# EAGLE design working (EAGLE 5.11)
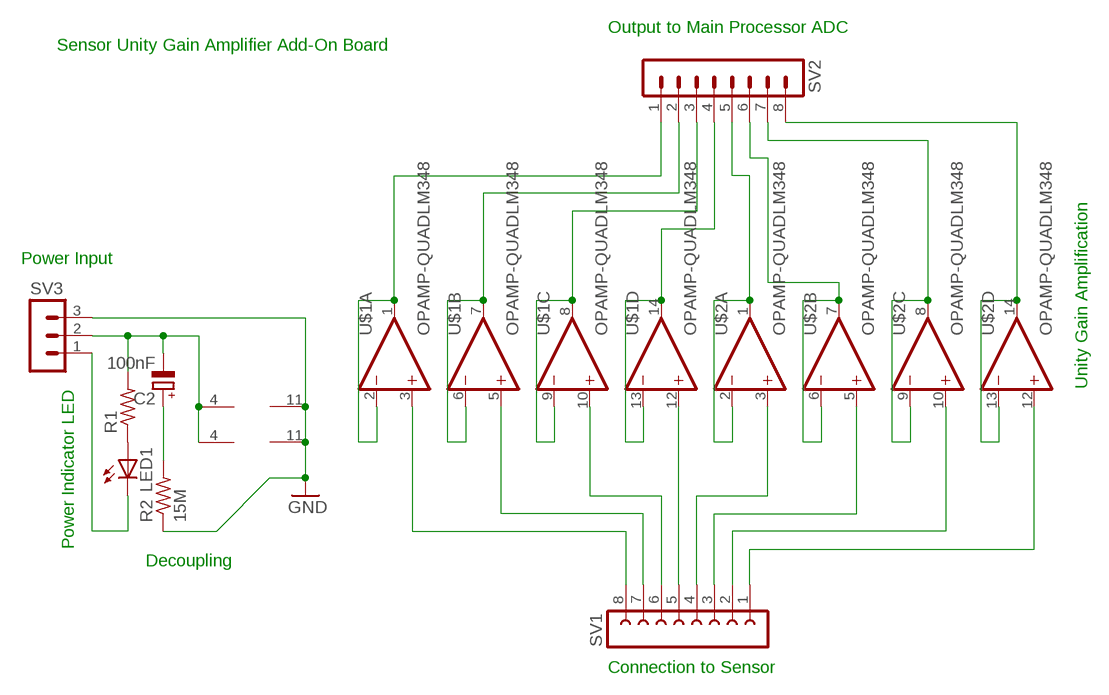
[diagram p0: schematic, sheet 1]

## Parts
C2  100nF  CPOL-EUE1.8-4  [E1,8-4]
LED1  LED5MM  [LED5MM]
R1  R-US_0204/5  [0204/5]
R2  15M  R-US_0204/5  [0204/5]
SV1  FE08-1  [FE08]
SV2  MA08-1  [MA08-1]
SV3  MA03-1  [MA03-1]
U$1  OPAMP-QUADLM348  [DIP14]
U$2  OPAMP-QUADLM348  [DIP14]

## Nets
GND: R2.1 SV3.3 U$1.11(SUP:VEE) U$2.11(SUP:VEE)
N$1: SV2.1 U$1.1(A:OUT) U$1.2(A:IN-)
N$2: SV2.2 U$1.6(B:IN-) U$1.7(B:OUT)
N$3: SV2.3 U$1.8(C:OUT) U$1.9(C:IN-)
N$4: SV2.4 U$1.13(D:IN-) U$1.14(D:OUT)
N$5: SV2.5 U$2.1(A:OUT) U$2.2(A:IN-)
N$6: SV2.6 U$2.6(B:IN-) U$2.7(B:OUT)
N$7: SV2.7 U$2.8(C:OUT) U$2.9(C:IN-)
N$8: SV2.8 U$2.13(D:IN-) U$2.14(D:OUT)
N$9: SV1.8 U$1.3(A:IN+)
N$10: SV1.7 U$1.5(B:IN+)
N$11: SV1.6 U$1.10(C:IN+)
N$12: SV1.5 U$1.12(D:IN+)
N$13: SV1.4 U$2.3(A:IN+)
N$14: SV1.3 U$2.5(B:IN+)
N$15: SV1.2 U$2.10(C:IN+)
N$16: SV1.1 U$2.12(D:IN+)
N$18: C2.+ R2.2
N$19: LED1.A R1.1
N$20: LED1.K(C) SV3.1
N$21: C2.- R1.2 SV3.2 U$1.4(SUP:VCC) U$2.4(SUP:VCC)

## Notes on the sheet
- Output to Main Processor ADC
- Sensor Unity Gain Amplifier Add-On Board
- Power Input
- Unity Gain Amplification
- Power Indicator LED
- Decoupling
- Connection to Sensor

## Library data of the parts
C2 = rcl:CPOL-EU: POLARIZED CAPACITOR, European symbol
LED1 = led:LED: LED OSRAM: - CHIPLED LG R971, LG N971, LY N971, LG Q971, LY Q971, LO R971, LY R971 LH N974, LH R974 LS Q976, LO Q976, LY Q976 LO Q996 - Hyper CHIPLED LW Q18S LB Q993, LB Q99A, LB R99A - SideLED LS A670, LO A670, LY A670, LG A670, LP A670 LB A673, LV A673, LT A673, LW A673 LH A674 LY A675 LS A676, LA A676, LO A676, LY A676, LW A676 LS A679, LY A679, LG A679 - Hyper Micro SIDELED® LS Y876, LA Y876, LO Y876, LY Y876 LT Y87S - SmartLED LW L88C, LW L88S LB L89C, LB L89S, LG L890 LS L89K, LO L89K, LY L89K LS L896, LA L896, LO L896, LY L896 - TOPLED LS T670, LO T670, LY T670, LG T670, LP T670 LSG T670, LSP T670, LSY T670, LOP T670, LYG T670 LG T671, LOG T671, LSG T671 LB T673, LV T673, LT T673, LW T673 LH T674 LS T676, LA T676, LO T676, LY T676, LB T676, LH T676, LSB T676, LW T676 LB T67C, LV T67C, LT T67C, LS T67K, LO T67K, LY T67K, LW E67C LS E67B, LA E67B, LO E67B, LY E67B, LB E67C, LV E67C, LT E67C LW T67C LS T679, LY T679, LG T679 LS T770, LO T770, LY T770, LG T770, LP T770 LB T773, LV T773, LT T773, LW T773 LH T774 LS E675, LA E675, LY E675, LS T675 LS T776, LA T776, LO T776, LY T776, LB T776 LHGB T686 LT T68C, LB T68C - Hyper Mini TOPLED® LB M676 - Mini TOPLED Santana® LG M470 LS M47K, LO M47K, LY M47K Source: http://www.osram.convergy.de LUXEON: - LUMILED® LXK2-PW12-R00, LXK2-PW12-S00, LXK2-PW14-U00, LXK2-PW14-V00 LXK2-PM12-R00, LXK2-PM12-S00, LXK2-PM14-U00 LXK2-PE12-Q00, LXK2-PE12-R00, LXK2-PE12-S00, LXK2-PE14-T00, LXK2-PE14-U00 LXK2-PB12-K00, LXK2-PB12-L00, LXK2-PB12-M00, LXK2-PB14-N00, LXK2-PB14-P00, LXK2-PB14-Q00 LXK2-PR12-L00, LXK2-PR12-M00, LXK2-PR14-Q00, LXK2-PR14-R00 LXK2-PD12-Q00, LXK2-PD12-R00, LXK2-PD12-S00 LXK2-PH12-R00, LXK2-PH12-S00 LXK2-PL12-P00, LXK2-PL12-Q00, LXK2-PL12-R00 Source: www.luxeon.com KINGBRIGHT: KA-3528ASYC Source: www.kingbright.com
R1 R2 = resistor:R-US_: RESISTOR, American symbol
SV1 = con-lsta:FE08-1: FEMALE HEADER; OC_FARNELL: unknown; OC_NEWARK: unknown
SV2 = con-lstb:MA08-1: PIN HEADER; OC_FARNELL: unknown; OC_NEWARK: unknown
SV3 = con-lstb:MA03-1: PIN HEADER; OC_FARNELL: unknown; OC_NEWARK: unknown
U$1 U$2 = Op Amps:OPAMP-QUAD: Operational amplifier, quad; SPICE: X{NAME}A {A.IN+.NET} {A.IN-.NET} {VCC.NET} {VEE.NET} {A.OUT.NET} LM348\nX{NAME}B {B.IN+.NET} {B.IN-.NET} {VCC.NET} {VEE.NET} {B.OUT.NET} LM348\nX{NAME}C {C.IN+.NET} {C.IN-.NET} {VCC.NET} {VEE.NET} {C.OUT.NET} LM348\nX{NAME}D {D.IN+.NET} {D.IN-.NET} {VCC.NET} {VEE.NET} {D.OUT.NET} LM348; SPICEMOD: .SUBCKT LM358 1 2 99 50 28\nIOS 2 1 5N\nR1 1 3 500K\nR2 3 2 500K\nI1 99 4 100U\nR3 5 50 517\nR4 6 50 517\nQ1 5 2 4 QX\nQ2 6 7 4 QX\nC4 5 6 128.27P\nI2 99 50 75U\nEOS 7 1 POLY(1) 16 49 2E-3 1\nR8 99 49 60K\nR9 49 50 60K\nV2 99 8 1.63\nD1 9 8 DX\nD2 10 9 DX\nV3 10 50 .635\nEH 99 98 99 49 1\nG1 98 9 POLY(1) 5 6 0 9.8772E-4 0 .3459\nR5 98 9 101.2433MEG\nC3 98 9 200P\nG3 98 15 9 49 1E-6\nR12 98 15 1MEG\nC5 98 15 7.9577E-14\nG4 98 16 3 49 5.6234E-8 \nL2 98 17 15.9M\nR13 17 16 1K\nF6 50 99 POLY(1) V6 300U 1\nE1 99 23 99 15 1\nR16 24 23 17.5\nD5 26 24 DX\nV6 26 22 .63V\nR17 23 25 17.5\nD6 25 27 DX\nV7 22 27 .63V\nV5 22 21 0.27V\nD4 21 15 DX\nV4 20 22 0.27V\nD3 15 20 DX\nL3 22 28 500P\nRL3 22 28 100K\n.MODEL DX D(IS=1E-15)\n.MODEL QX PNP(BF=1.111E3)\n.ENDS

## Board
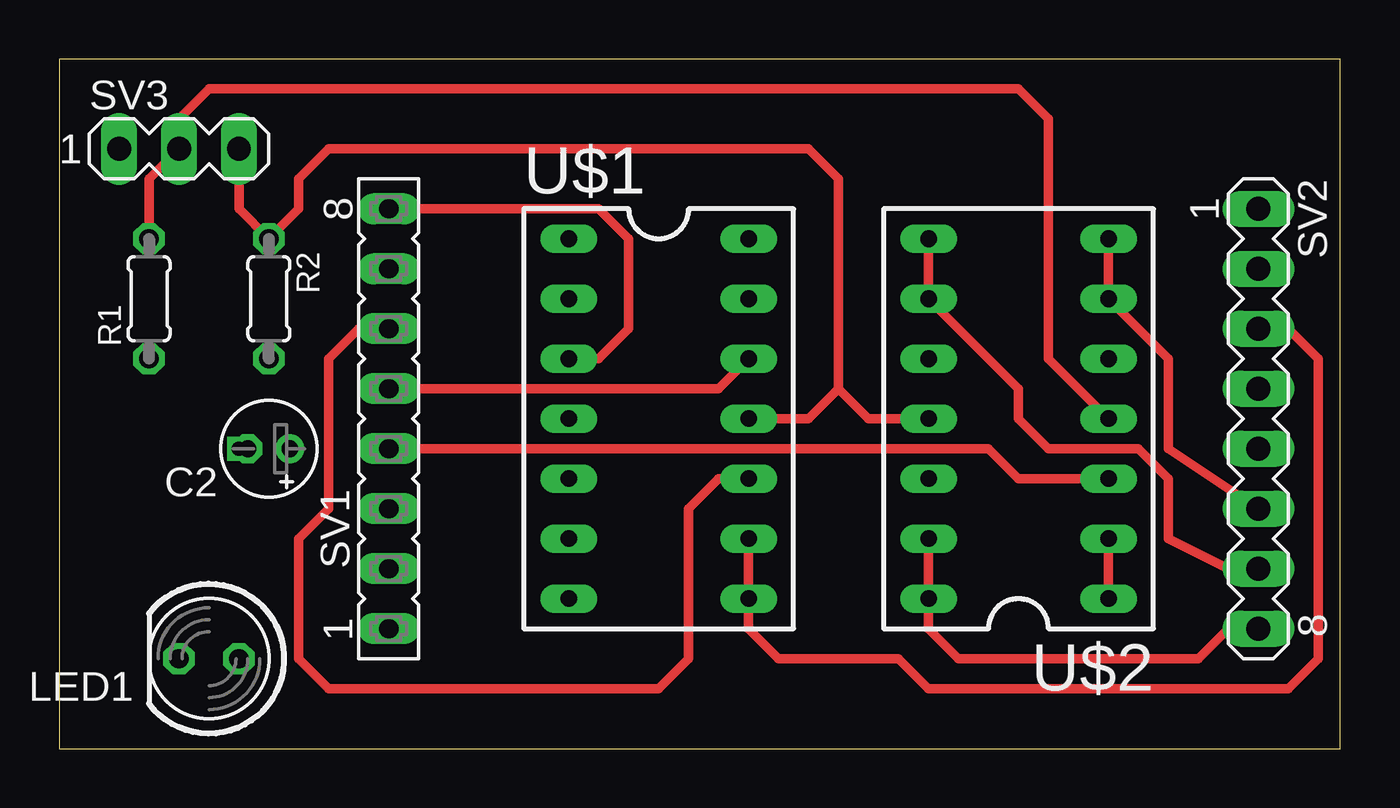
[diagram p1: board, top side]
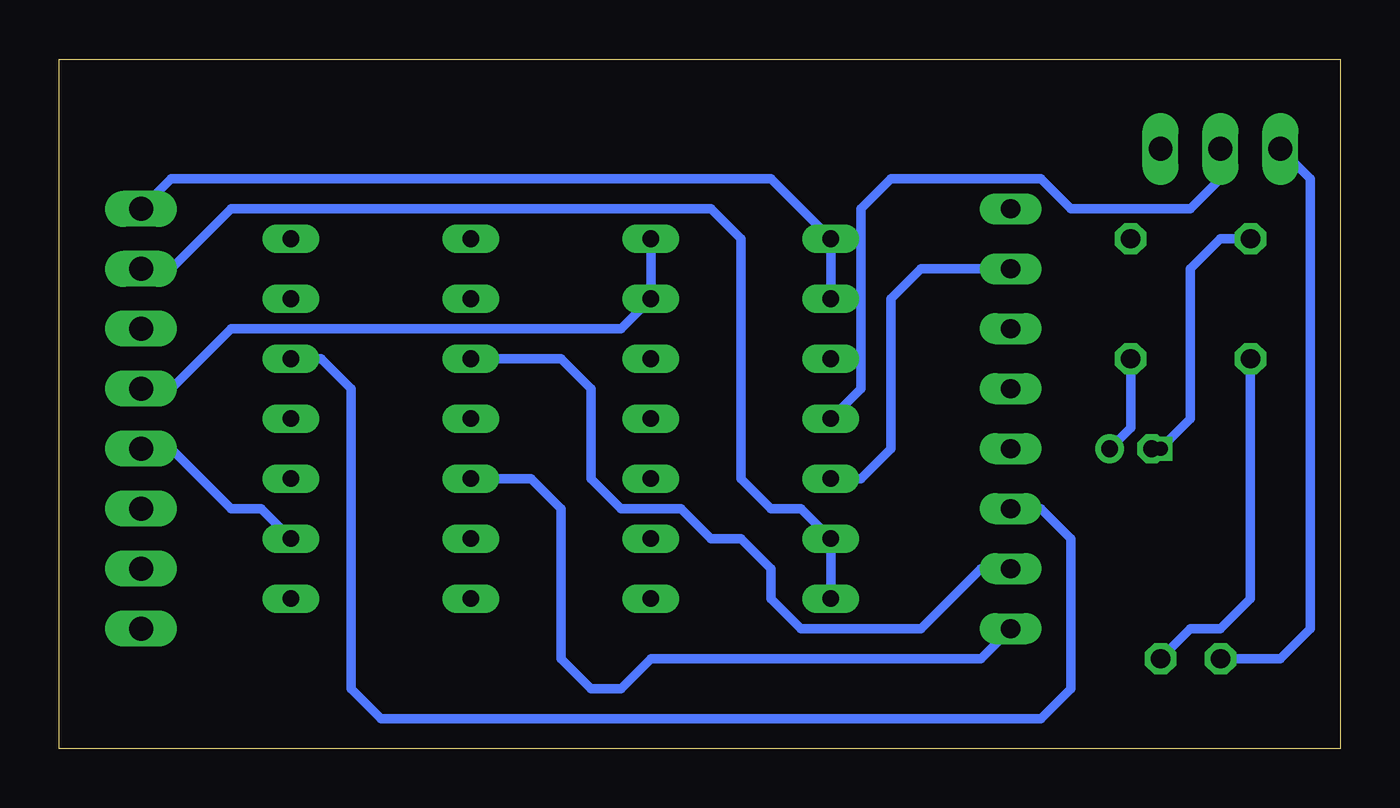
[diagram p2: board, bottom side, seen from below]

Size 54.28 x 29.2 mm. Coordinates in mm from the lower left corner, seen from the top.
Outline: 0,0 54.28,0 54.28,29.2 0,29.2 0,0
Copper layers (1*16): Top 0.035mm / dielectric 1.5mm / Bottom 0.035mm
Design rules "default": minimum track width 10mil, minimum drill 24mil, track to track 8mil, track to pad 8mil, pad to pad 8mil, via to via 8mil, smd to smd 8mil, copper to edge 40mil, drill to drill 8mil, minimum pad ring 10mil, minimum via ring 8mil, stop-mask expansion 4mil, vias tented up to drill 0mil, thermal gap 10mil

### Footprints (pad centres in the part's own frame; a part is rotated, then mirrored left to right if it is on the bottom)
E1,8-4 = drill 0.711 pad 1.168 round: + -0.889,0 | drill 0.711 pad 1.168 octagon: - 0.889,0
LED5MM = drill 0.813 octagon: A -1.27,0; K 1.27,0
0204/5 = drill 0.813 octagon: 1 -2.54,0; 2 2.54,0
FE08 = drill 0.813 long: 1 -8.89,0; 2 -6.35,0; 3 -3.81,0; 4 -1.27,0; 5 1.27,0; 6 3.81,0; 7 6.35,0; 8 8.89,0
MA08-1 = drill 1.016 long: 1 -8.89,0; 2 -6.35,0; 3 -3.81,0; 4 -1.27,0; 5 1.27,0; 6 3.81,0; 7 6.35,0; 8 8.89,0
MA03-1 = drill 1.016 long: 1 -2.54,0; 2 0,0; 3 2.54,0
DIP14 = drill 0.7 long: 1 0,7.62; 2 0,5.08; 3 0,2.54; 4 0,0; 5 0,-2.54; 6 0,-5.08; 7 0,-7.62; 8 7.62,-7.62; 9 7.62,-5.08; 10 7.62,-2.54; 11 7.62,0; 12 7.62,2.54; 13 7.62,5.08; 14 7.62,7.62

### Placement (x,y rotation side)
C2  8.89,12.7 180 top
LED1  6.35,3.81 180 top
R1  3.81,19.05 90 top
R2  8.89,19.05 270 top
SV1  13.97,13.97 90 top
SV2  50.8,13.97 270 top
SV3  5.08,25.4 0 top
U$1  21.59,13.97 0 top
U$2  44.45,13.97 180 top

### Tracks (layer width: path | path; a pad name or v marks a point on that pad's centre or on a via)
GND
  Top 0.406: SV3.3 7.62,22.86 R2.1 10.16,22.86 10.16,24.13 11.43,25.4 31.75,25.4 33.02,24.13 33.02,15.24 | 33.02,15.24 31.75,13.97 U$1.11 | 33.02,15.24 34.29,13.97 U$2.11
N$1
  Bottom 0.406: U$1.2 U$1.1 24.13,24.13 49.53,24.13 SV2.1
N$2
  Bottom 0.406: U$1.7 U$1.6 22.86,10.16 24.13,10.16 25.4,11.43 25.4,21.59 26.67,22.86 46.99,22.86 49.53,20.32 SV2.2
N$3
  Top 0.406: U$1.9 U$1.8 29.21,5.08 30.48,3.81 35.56,3.81 36.83,2.54 52.07,2.54 53.34,3.81 53.34,16.51 52.07,17.78 SV2.3
N$4
  Bottom 0.406: U$1.14 U$1.13 30.48,17.78 46.99,17.78 49.53,15.24 SV2.4
N$5
  Top 0.406: U$2.1 U$2.2
  Bottom 0.406: U$2.2 45.72,10.16 46.99,10.16 49.53,12.7 SV2.5
N$6
  Top 0.406: U$2.7 U$2.6 46.99,16.51 46.99,12.7 SV2.6
N$7
  Top 0.406: U$2.8 U$2.9 40.64,15.24 40.64,13.97 41.91,12.7 45.72,12.7 46.99,11.43 46.99,8.89 49.53,7.62 SV2.7
N$8
  Top 0.406: U$2.13 U$2.14 36.83,5.08 38.1,3.81 48.26,3.81 49.53,5.08 SV2.8
N$9
  Top 0.406: SV1.8 22.86,22.86 24.13,21.59 24.13,17.78 22.86,16.51 U$1.3
N$10
  Bottom 0.406: U$1.5 20.32,11.43 19.05,12.7 19.05,19.05 17.78,20.32 SV1.7
N$11
  Top 0.406: SV1.6 12.7,17.78 11.43,16.51 11.43,10.16 10.16,8.89 10.16,3.81 11.43,2.54 25.4,2.54 26.67,3.81 26.67,10.16 27.94,11.43 U$1.10
N$12
  Top 0.406: SV1.5 27.94,15.24 U$1.12
N$13
  Top 0.406: SV1.4 39.37,12.7 40.64,11.43 U$2.3
N$14
  Bottom 0.406: SV1.3 12.7,10.16 11.43,8.89 11.43,2.54 12.7,1.27 40.64,1.27 41.91,2.54 41.91,15.24 43.18,16.51 U$2.5
N$15
  Bottom 0.406: SV1.2 15.24,7.62 17.78,5.08 22.86,5.08 24.13,6.35 24.13,7.62 25.4,8.89 26.67,8.89 27.94,10.16 30.48,10.16 31.75,11.43 31.75,15.24 33.02,16.51 U$2.10
N$16
  Bottom 0.406: SV1.1 15.24,3.81 29.21,3.81 30.48,2.54 31.75,2.54 33.02,3.81 33.02,10.16 34.29,11.43 U$2.12
N$18
  Bottom 0.406: R2.2 8.89,13.59 C2.+
N$19
  Bottom 0.406: R1.1 3.81,6.35 5.08,5.08 6.35,5.08 LED1.A
N$20
  Bottom 0.406: SV3.1 1.27,24.13 1.27,5.08 2.54,3.81 LED1.K
N$21  (via drill 0.6)
  Top 0.406: U$2.4 41.91,16.51 41.91,26.67 40.64,27.94 6.35,27.94 5.08,26.67 SV3.2 3.81,24.13 R1.2
  Bottom 0.406: C2.- v7.62,12.7 6.35,13.97 6.35,20.32 5.08,21.59 R1.2 | SV3.2 5.08,24.13 6.35,22.86 11.43,22.86 12.7,24.13 19.05,24.13 20.32,22.86 20.32,15.24 U$1.4